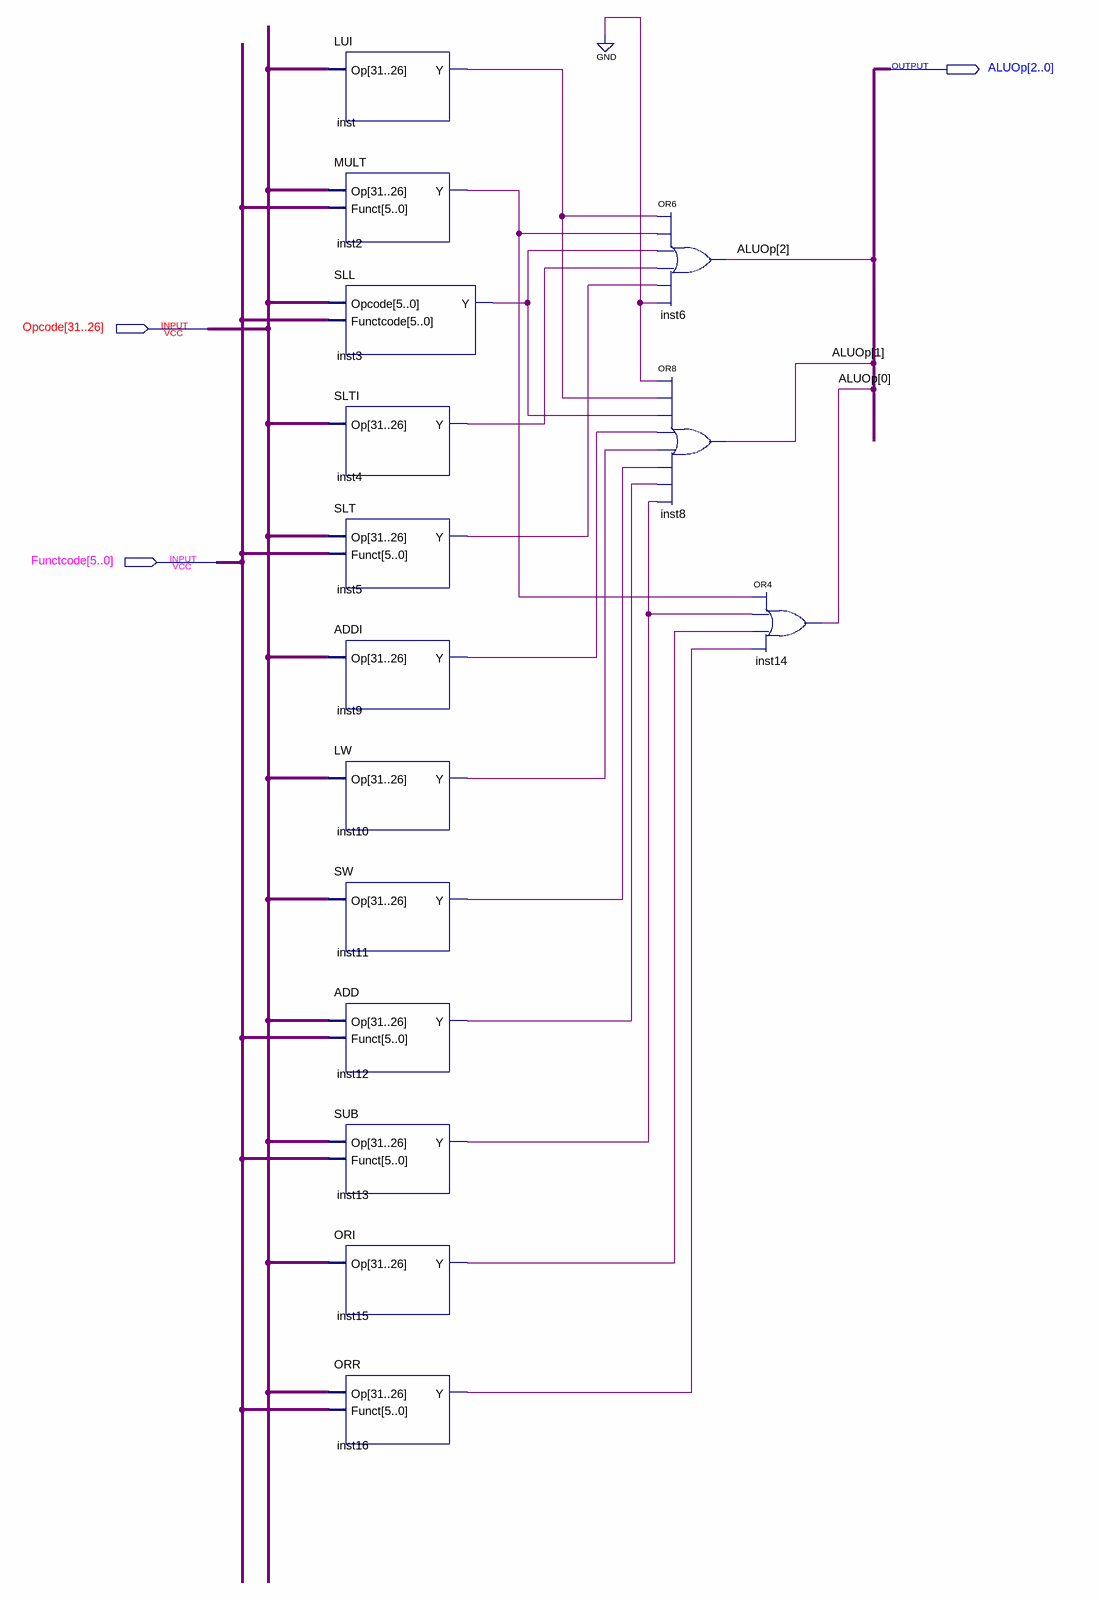
[diagram p0: schematic sheet]
// Quartus schematic ALUCtl.bdf as structural Verilog: 15 symbols, 3 pins
module ALUCtl (
  input  [31:26] Opcode,
  input  [5:0] Functcode,
  output [2:0] ALUOp
);

  wire inst2_y, inst3_y, inst4_y, inst5_y, inst9_y, inst10_y, inst11_y, inst12_y, inst13_y, inst15_y,
       inst16_y, inst_y;

  LUI inst (.Op(Opcode), .Y(inst_y));
  MULT inst2 (.Op(Opcode), .Funct(Functcode), .Y(inst2_y));
  SLL inst3 (.Opcode(Opcode), .Functcode(Functcode), .Y(inst3_y));
  SLTI inst4 (.Op(Opcode), .Y(inst4_y));
  SLT inst5 (.Op(Opcode), .Funct(Functcode), .Y(inst5_y));
  ADDI inst9 (.Op(Opcode), .Y(inst9_y));
  LW inst10 (.Op(Opcode), .Y(inst10_y));
  SW inst11 (.Op(Opcode), .Y(inst11_y));
  ADD inst12 (.Op(Opcode), .Funct(Functcode), .Y(inst12_y));
  SUB inst13 (.Op(Opcode), .Funct(Functcode), .Y(inst13_y));
  ORI inst15 (.Op(Opcode), .Y(inst15_y));
  ORR inst16 (.Op(Opcode), .Funct(Functcode), .Y(inst16_y));
  or inst6 (ALUOp[2], inst_y, inst2_y, inst3_y, inst4_y, inst5_y, 1'b0);
  or inst8 (ALUOp[1], 1'b0, inst_y, inst3_y, inst9_y, inst10_y, inst11_y, inst12_y, inst13_y);
  or inst14 (ALUOp[0], inst2_y, inst13_y, inst15_y, inst16_y);
endmodule
